# Altium project jlink-adapter.PrjPcb
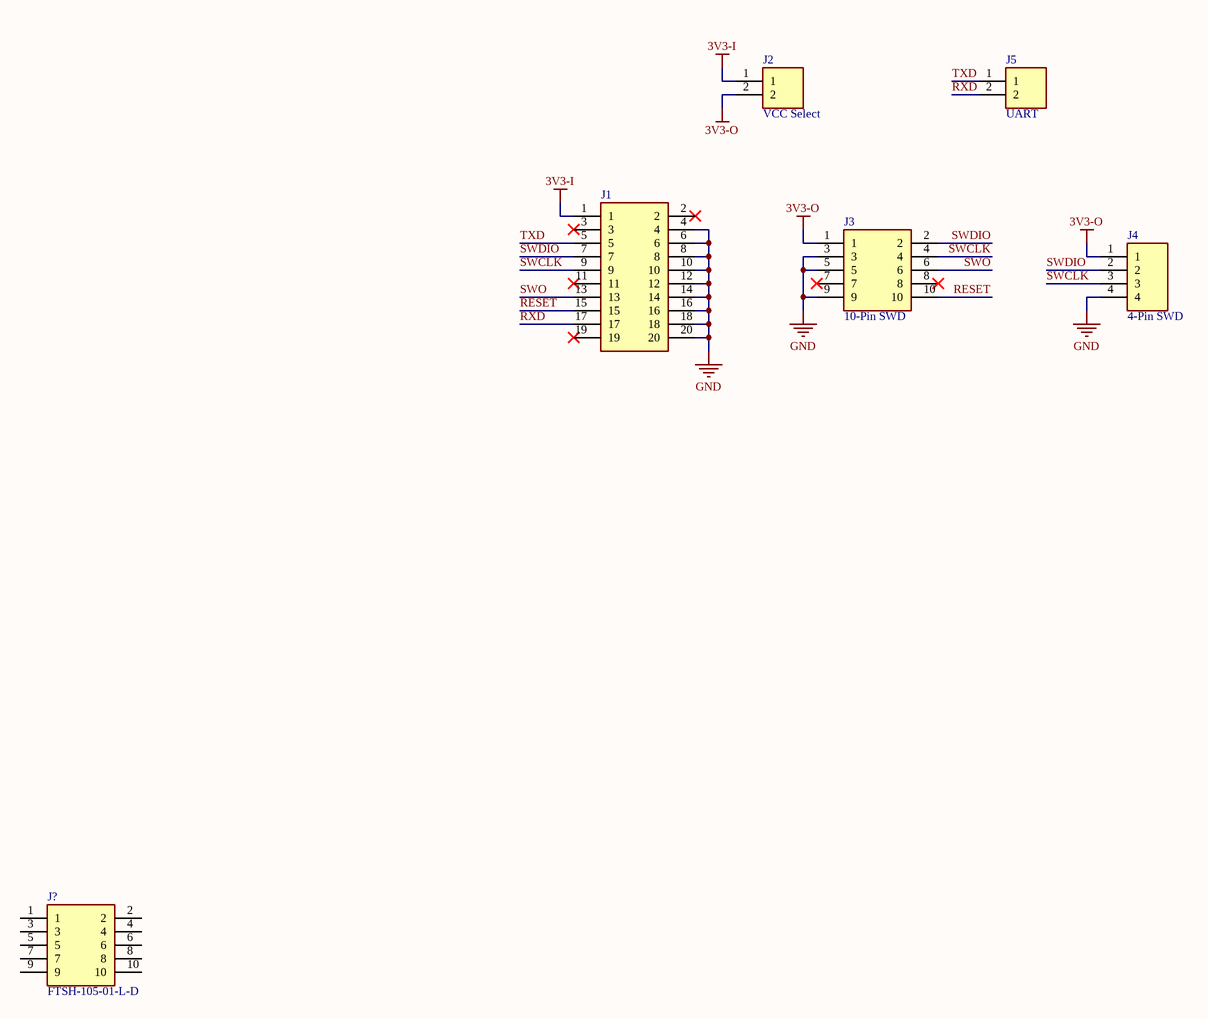
[diagram p0: jlink-adapter.SchDoc]
1 sheet, 6 parts. Net scope: global (net labels, ports and power ports of the same name join across sheets).
Board files: jlink-adapter.PcbDoc, jlink-adapter-panel.PcbDoc

## Sheet jlink-adapter.SchDoc
size A3; SheetNumber: 1; SheetTotal: 1

### Parts
J1  (no value)  [CONN_BOX_2x10_2.54_90_THT]
J2  VCC Select  [CONN_1x2_2.54_THT]
J3  10-Pin SWD  [CONN_BOX_2x5_1.27_90_THT]
J4  4-Pin SWD  [WF_4]
J5  UART  [CONN_1x2_2.54_THT]
J?  FTSH-105-01-L-D  [FTSH-105-XX-YYY-D]

### Nets
3V3-I: J1.1 J2.1
3V3-O: J2.2 J3.1 J4.1
GND: J1.4 J1.6 J1.8 J1.10 J1.12 J1.14 J1.16 J1.18 J1.20 J3.3 J3.5 J3.9 J4.4
RESET: J1.15 J3.10
RXD: J1.17 J5.2
SWCLK: J1.9 J3.4 J4.3
SWDIO: J1.7 J3.2 J4.2
SWO: J1.13 J3.6
TXD: J1.5 J5.1

Not connected (* = marked no-connect by the designer): J1 2* 3* 11* 19*; J3 7* 8*; J? 1 2 3 4 5 6 7 8 9 10

### Library data of the parts
J1 = CONN 2x10: Connector
J2 J5 = CONN 1x2: Connector
J3 = CONN 2x5: Connector; Özdisan Kodu: L-KLS1-202C-10-S-B; ComponentLink1Description: Özdisan Link; ComponentLink1URL: https://ozdisan.com/konnektor-ve-baglanti-elemanlari/header-konnektorler/box-headerlar/L-KLS1-202C-10-S-B
J4 = CONN 1x4: Connector; Özdisan Kodu: DS1070-3MVV6; ComponentLink1Description: Özdisan Link; ComponentLink1URL: https://ozdisan.com/konnektor-ve-baglanti-elemanlari/konnektor-cesitleri/pcb-konnektorler/DS1070-3MVV6
J? = FTSH-105-01-L-D: Connector; Manufacturer_Name: SAMTEC; Datasheet Link: http://suddendocs.samtec.com/prints/ftsh-1xx-xx-xxx-d-xxx-xx-mkt.pdf; Manufacturer_Part_Number: FTSH-105-01-L-D; Mouser Part Number: 200-FTSH10501LD; Mouser Price/Stock: https://www.mouser.co.uk/ProductDetail/Samtec/FTSH-105-01-L-D?qs=fnpEE5GccuNyfCnEPBaTfQ%3D%3D; Arrow Part Number: FTSH-105-01-L-D; Arrow Price/Stock: https://www.arrow.com/en/products/ftsh-105-01-l-d/samtec